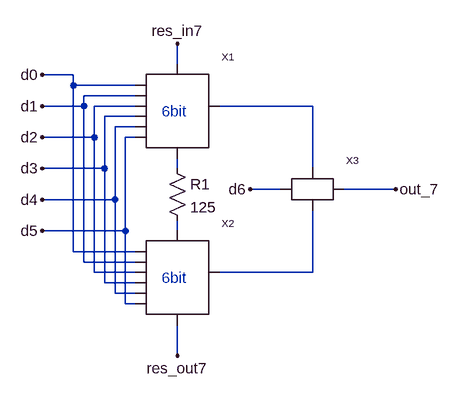
[diagram p0: schematic level6.asc]
level6.asc, the LTspice schematic file:
Version 4
SHEET 1 880 680
WIRE 160 32 160 0
WIRE 0 48 -48 48
WIRE 0 64 0 48
WIRE 96 64 0 64
WIRE 96 80 16 80
WIRE 16 96 16 80
WIRE 16 96 -48 96
WIRE 96 96 32 96
WIRE 368 96 224 96
WIRE 96 112 48 112
WIRE 96 128 64 128
WIRE 32 144 32 96
WIRE 32 144 -48 144
WIRE 96 144 80 144
WIRE 48 192 48 112
WIRE 48 192 -48 192
WIRE 160 192 160 176
WIRE 368 192 368 96
WIRE 320 224 272 224
WIRE 496 224 416 224
WIRE 64 240 64 128
WIRE 64 240 -48 240
WIRE 80 288 80 144
WIRE 80 288 -48 288
WIRE 160 288 160 272
WIRE 0 320 0 64
WIRE 96 320 0 320
WIRE 16 336 16 96
WIRE 96 336 16 336
WIRE 32 352 32 144
WIRE 96 352 32 352
WIRE 368 352 368 256
WIRE 368 352 224 352
WIRE 48 368 48 192
WIRE 96 368 48 368
WIRE 64 384 64 240
WIRE 96 384 64 384
WIRE 80 400 80 288
WIRE 96 400 80 400
WIRE 160 480 160 432
FLAG -48 96 d1
FLAG -48 144 d2
FLAG -48 192 d3
FLAG -48 240 d4
FLAG -48 288 d5
FLAG -48 48 d0
FLAG 496 224 out_7
FLAG 272 224 d6
FLAG 160 480 res_out7
FLAG 160 0 res_in7
SYMBOL level5 160 112 R0
SYMATTR InstName X1
SYMBOL level5 160 368 R0
SYMATTR InstName X2
SYMBOL res 144 176 R0
SYMATTR InstName R1
SYMATTR Value 125
SYMBOL switch 368 224 R0
SYMATTR InstName X3
TEXT 136 104 Left 2 ;6bit
TEXT 136 360 Left 2 ;6bit

The netlist it stands for:
* level6.asc
XX1 d0 d1 d2 d3 d4 d5 res_in7 N002 N001 level5  ; pins d0 d1 d2 d3 d4 d5 res_in6 res_out6 out_6
XX2 d0 d1 d2 d3 d4 d5 N003 res_out7 N004 level5  ; pins d0 d1 d2 d3 d4 d5 res_in6 res_out6 out_6
R1 N002 N003 125
XX3 d6 N001 N004 out_7 switch  ; pins dig_in in_1 in_2 Vout
* 6bit
* 6bit
.backanno
.end